# EAGLE board CSv2.1_exp_board (EAGLE 9.6.2)
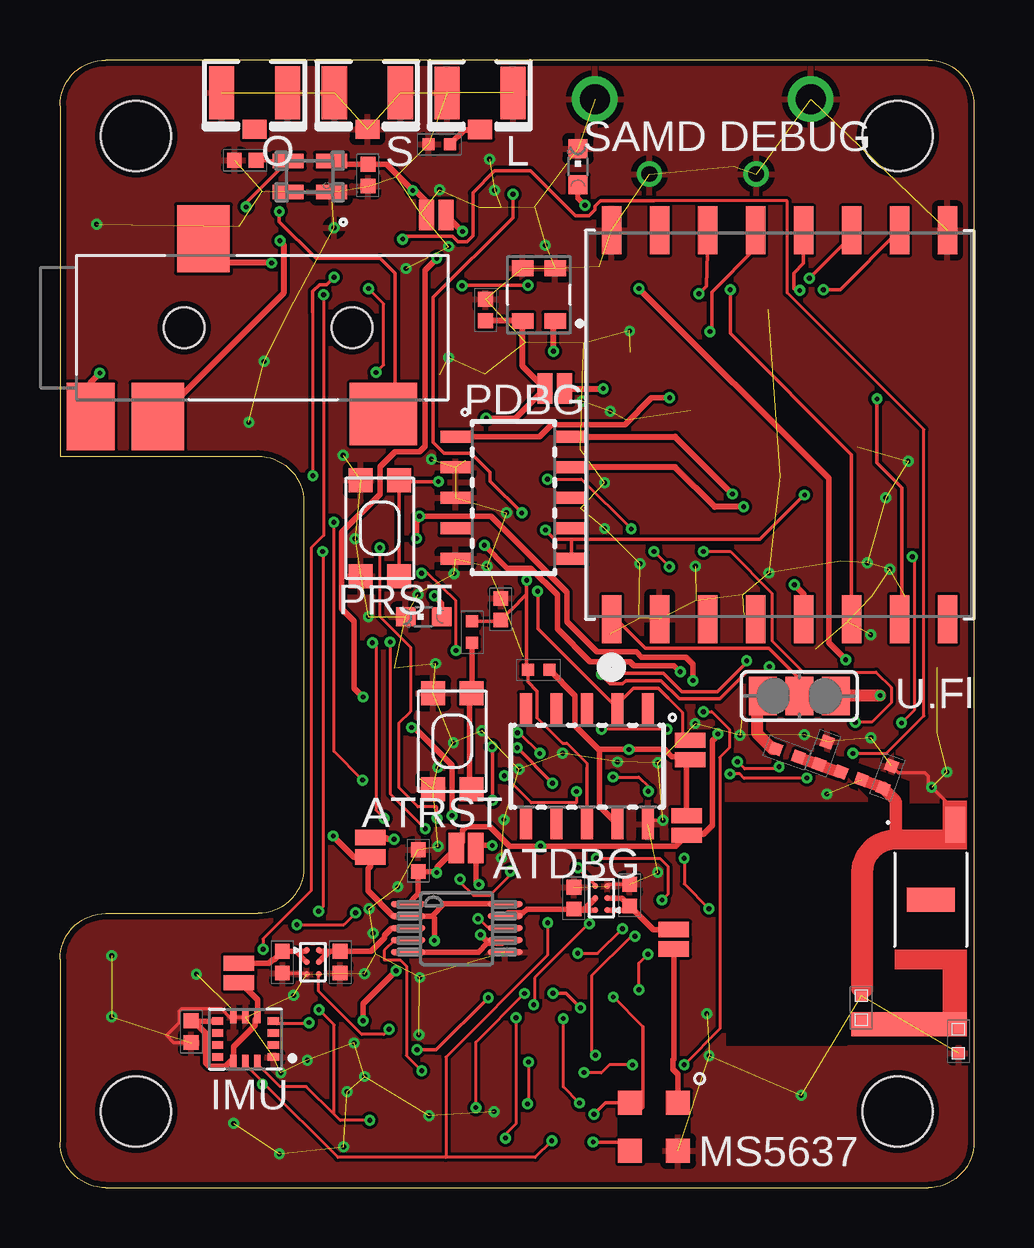
[diagram p4: board, top side]
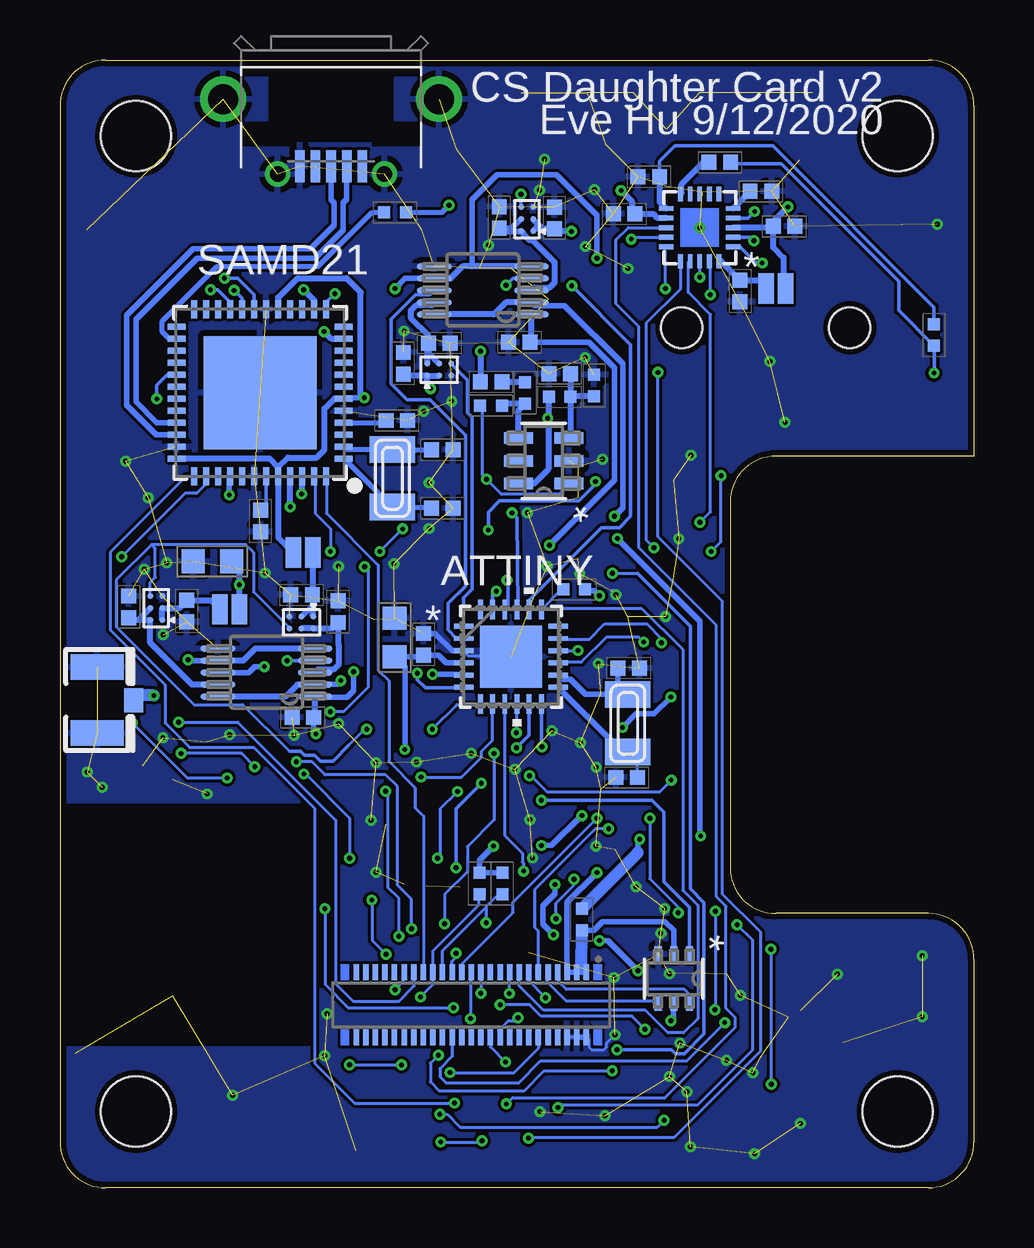
[diagram p5: board, bottom side, seen from below]

Size 38.1 x 46.99 mm. Coordinates in mm from the lower left corner, seen from the top.
Outline: 1.91,0 36.2,0 arc90 38.1,1.91 38.1,45.09 arc90 36.2,46.99 1.91,46.99 arc90 0,45.09 0,30.48 8.26,30.48 arc-90 10.16,28.57 10.16,13.34 arc-90 8.26,11.43 1.91,11.43 arc90 0,9.53 0,1.91 arc90 1.91,0
Copper layers (1*16): Top 0.034796875mm / dielectric 0.231140625mm / Bottom 0.034796875mm
Design rules "CSv2_bittele_4-layer *": minimum track width 5mil, minimum drill 0.2mm, track to track 5mil, track to pad 5mil, pad to pad 5mil, via to via 5mil, smd to smd 5mil, copper to edge 10mil, drill to drill 5mil, minimum pad ring 5mil, minimum via ring 5mil, stop-mask expansion 4mil, vias tented up to drill 0mil, thermal gap 10mil
Net classes: 0 default: width 0.127 mm, drill 0.152 mm, clearance 0.127 mm; 1 power: width 0.229 mm, drill 0.178 mm, clearance 0.127 mm; 2 diff_pair: width 0.229 mm; 3 12mil: width 0.305 mm, drill 0.33 mm; 8 GND: width 0.127 mm
Holes 2.92 mm at 3.17,43.81 34.92,43.81 3.17,3.17 34.92,3.17

## Footprints (pad centres in the part's own frame; a part is rotated, then mirrored left to right if it is on the bottom)
ILA_09_CHIP_ANTENNA = smd 1.5 x 0.8: G1 -3.11,1.02 | smd 1 x 4.8: G2 5.2,-0.9 | smd 1 x 2: NC 0,0
C0402 = smd 0.62 x 0.62: 1 -0.45,0; 2 0.45,0
C0402-S = smd 0.5 x 0.5: 1 -0.5,0; 2 0.5,0
C0603 = smd 0.95 x 1: 1 -0.8,0; 2 0.8,0
CHIPLED_0603 = smd 0.8 x 0.8: A 0,-0.75; C 0,0.75
HRS_DF40C-50DP-0.4V(51) = smd 0.23 x 0.66: 1 -4.8,1.355; 2 -4.8,-1.355; 3 -4.4,1.355; 4 -4.4,-1.355; 5 -4,1.355; 6 -4,-1.355; 7 -3.6,1.355; 8 -3.6,-1.355; 9 -3.2,1.355; 10 -3.2,-1.355; 11 -2.8,1.355; 12 -2.8,-1.355; 13 -2.4,1.355; 14 -2.4,-1.355; 15 -2,1.355; 16 -2,-1.355; 17 -1.6,1.355; 18 -1.6,-1.355; 19 -1.2,1.355; 20 -1.2,-1.355; 21 -0.8,1.355; 22 -0.8,-1.355; 23 -0.4,1.355; 24 -0.4,-1.355; 25 0,1.355; 26 0,-1.355; 27 0.4,1.355; 28 0.4,-1.355; 29 0.8,1.355; 30 0.8,-1.355; 31 1.2,1.355; 32 1.2,-1.355; 33 1.6,1.355; 34 1.6,-1.355; 35 2,1.355; 36 2,-1.355; 37 2.4,1.355; 38 2.4,-1.355; 39 2.8,1.355; 40 2.8,-1.355; 41 3.2,1.355; 42 3.2,-1.355; 43 3.6,1.355; 44 3.6,-1.355; 45 4,1.355; 46 4,-1.355; 47 4.4,1.355; 48 4.4,-1.355; 49 4.8,1.355; 50 4.8,-1.355
SAMTECH_FTSH-105-01 = smd 0.508 x 1.27: 1 -2.54,-2.413; 2 -2.54,2.413; 3 -1.27,-2.413; 4 -1.27,2.413; 5 0,-2.413; 6 0,2.413; 7 1.27,-2.413; 8 1.27,2.413; 9 2.54,-2.413; 10 2.54,2.413
CUI_SJ-43514-SMT-TEMP = smd 2 x 2.8: 1 -7.15,-3.7 | smd 2.8 x 2.6: 2 5.05,-3.6 | smd 2.2 x 2.8: 3 -2.45,3.7; 4 -4.35,-3.7 | hole 1.7: -3.25,0; 3.75,0
USB-THRU-ZX62D-AB-5P8 = smd 1.35 x 0.4: D+ 2.8,0; D- 2.8,0.65; GND 2.8,-1.3; USBID 2.8,-0.65; VBUS 2.8,1.3 | drill 1.25 pad 1.9: S1 0,-4.5; S2 0,4.5 | drill 0.65 pad 1.05: S3 3.125,2.225; S4 3.125,-2.225
SMT-JUMPER_2_NC_PASTE_NO-SILK = smd 0.635 x 1.27: 1 -0.406,0; 2 0.406,0
SMT-JUMPER_2_NO_PASTEFREE_NO-SILK = smd 0.635 x 1.27: 1 -0.406,0; 2 0.406,0
MIC_SPW2430HR5H-B = smd 0.9 x 0.66: 1 -0.675,1.095; 2 -0.675,-1.095; 3 0.675,-1.095; 4 0.675,1.095
R0402 = smd 0.5 x 0.5: 1 -0.45,0; 2 0.45,0
L0402 = smd 0.5 x 0.5: 1 -0.45,0; 2 0.45,0
JUMPER_SJ_2 = smd 1.168 x 1.6: 1 -1.524,0; 2 0,0; 3 1.524,0
KMR2 = smd 1 x 1: 1 2,0.8; 2 2,-0.8; 3 -2,0.8; 4 -2,-0.8
WLCSP6_2X3 = smd 0.254 x 0.254: A1 -0.25,0.5; A2 0.25,0.5; B1 -0.25,0; B2 0.25,0; C1 -0.25,-0.5; C2 0.25,-0.5
RJ_6-L = smd 1.206 x 0.48: 1 -1.049,0.95; 2 -1.049,0; 3 -1.049,-0.95; 4 1.049,-0.95; 5 1.049,0; 6 1.049,0.95
DGS0010A_L = smd 1.45 x 0.25: 1 -2.025,1; 2 -2.025,0.5; 3 -2.025,0; 4 -2.025,-0.5; 5 -2.025,-1; 6 2.025,-1; 7 2.025,-0.5; 8 2.025,0; 9 2.025,0.5; 10 2.025,1
RFM-MOD = smd 2 x 0.8: 1P 8.1,-7; 2P 8.1,-5; 3P 8.1,-3; 4P 8.1,-1; 5P 8.1,1; 6P 8.1,3; 7P 8.1,5; 8P 8.1,7; 9P -8.1,7; 10P -8.1,5; 11P -8.1,3; 12P -8.1,1; 13P -8.1,-1; 14P -8.1,-3; 15P -8.1,-5; 16P -8.1,-7
PQFN50P300X250X88-14N = smd 0.5 x 0.3: 1 -1.165,0.75; 2 -1.165,0.25; 3 -1.165,-0.25; 4 -1.165,-0.75; 8 1.165,-0.75; 9 1.165,-0.25; 10 1.165,0.25; 11 1.165,0.75 | smd 0.3 x 0.5: 5 -0.5,-0.915; 6 0,-0.915; 7 0.5,-0.915; 12 0.5,0.915; 13 0,0.915; 14 -0.5,0.915
KS_6_ADI-L = smd 0.673 x 0.305: 1 -1.01,0.65; 2 -1.01,0; 3 -1.01,-0.65; 4 1.01,-0.65; 5 1.01,0; 6 1.01,0.65
SC-82AB_ONS-L = smd 0.61 x 1.295: 1 -0.65,-0.902; 2 0.65,-0.902; 3 0.65,0.902; 4 -0.65,0.902
ATTINY817-MFRQFN24_RX4MC-L_QFN24_4X4MC = smd 0.813 x 0.203: 1 -1.968,1.27; 2 -1.968,0.762; 3 -1.968,0.254; 4 -1.968,-0.254; 5 -1.968,-0.762; 6 -1.968,-1.27; 13 1.968,-1.27; 14 1.968,-0.762; 15 1.968,-0.254; 16 1.968,0.254; 17 1.968,0.762; 18 1.968,1.27 | smd 0.203 x 0.813: 7 -1.27,-1.968; 8 -0.762,-1.968; 9 -0.254,-1.968; 10 0.254,-1.968; 11 0.762,-1.968; 12 1.27,-1.968; 19 1.27,1.968; 20 0.762,1.968; 21 0.254,1.968; 22 -0.254,1.968; 23 -0.762,1.968; 24 -1.27,1.968 | smd 2.591 x 2.591: 25 0,0
MICROBUILDER_TQFN48_7MM = smd 0.25 x 0.75: 1 -2.75,-3.475; 2 -2.25,-3.475; 3 -1.75,-3.475; 4 -1.25,-3.475; 5 -0.75,-3.475; 6 -0.25,-3.475; 7 0.25,-3.475; 8 0.75,-3.475; 9 1.25,-3.475; 10 1.75,-3.475; 11 2.25,-3.475; 12 2.75,-3.475; 25 2.75,3.475; 26 2.25,3.475; 27 1.75,3.475; 28 1.25,3.475; 29 0.75,3.475; 30 0.25,3.475; 31 -0.25,3.475; 32 -0.75,3.475; 33 -1.25,3.475; 34 -1.75,3.475; 35 -2.25,3.475; 36 -2.75,3.475 | smd 0.75 x 0.25: 13 3.475,-2.75; 14 3.475,-2.25; 15 3.475,-1.75; 16 3.475,-1.25; 17 3.475,-0.75; 18 3.475,-0.25; 19 3.475,0.25; 20 3.475,0.75; 21 3.475,1.25; 22 3.475,1.75; 23 3.475,2.25; 24 3.475,2.75; 37 -3.475,2.75; 38 -3.475,2.25; 39 -3.475,1.75; 40 -3.475,1.25; 41 -3.475,0.75; 42 -3.475,0.25; 43 -3.475,-0.25; 44 -3.475,-0.75; 45 -3.475,-1.25; 46 -3.475,-1.75; 47 -3.475,-2.25; 48 -3.475,-2.75 | smd 4.7 x 4.7: THERMAL 0,0
MS5637 = smd 1 x 1: 1 -1,1; 2 -1,-1; 3 1,-1; 4 1,1
SGTL5000-QFN20 = smd 0.6 x 0.2: P$1 -1.4,0.8; P$2 -1.4,0.4; P$3 -1.4,0; P$4 -1.4,-0.4; P$5 -1.4,-0.8; P$11 1.4,-0.8; P$12 1.4,-0.4; P$13 1.4,0; P$14 1.4,0.4; P$15 1.4,0.8 | smd 0.2 x 0.6: P$6 -0.8,-1.4; P$7 -0.4,-1.4; P$8 0,-1.4; P$9 0.4,-1.4; P$10 0.8,-1.4; P$16 0.8,1.4; P$17 0.4,1.4; P$18 0,1.4; P$19 -0.4,1.4; P$20 -0.8,1.4 | drill 0.2: PAD 0,0
ADAFRUIT2_XTAL3215 = smd 1.1 x 1.9: P$1 1.2,0; P$2 -1.2,0
U.FL = smd 2.2 x 1.05: 1 0,1.375; 2 0,-1.375 | smd 0.8 x 1: 3 1.525,0

## Placement (x,y rotation side)
A1  ILA09_CHIP_ANTENNA  [ILA_09_CHIP_ANTENNA]  36.29,12.01 270 top
C1  1u  [C0402]  29.74,27.78 270 bottom
C2  5.5p  [C0402]  22.16,28.31 0 bottom
C3  3.9p  [C0402-S]  37.46,6.1 90 top
C4  5.5p  [C0402]  22.16,30.75 0 bottom
C5  2.2p  [C0402-S]  33.4,7.5 270 top
C6  0.68u  [C0402]  20.13,33.58 0 bottom
C7  0.1u  [C0402]  17.74,36.58 90 top
C8  1u  [C0402]  17.27,33.92 180 bottom
C9  10u  [C0603]  31.75,26.1 180 bottom
C10  1u  [C0402]  26.5,24 90 bottom
C11  0.1u  [C0402]  28.03,24.7 180 bottom
C12  4.7u  [C0603]  24.14,22.92 270 bottom
C13  0.1u  [C0402]  22.94,22.64 270 bottom
C14  1u  [C0402]  24.06,31.97 0 bottom
C15  13pF  [C0402]  14.48,17.09 0 bottom
C16  13pF  [C0402]  14.39,21.65 180 bottom
C17  1u  [C0402]  35.23,24.21 90 bottom
C18  0.1u  [C0402]  32.82,24.03 270 bottom
C19  1u  [C0402]  21.42,12.06 90 top
C20  0.1u  [C0402]  23.75,12.19 90 top
C21  1u  [C0402]  11.68,9.4 270 top
C22  0.1u  [C0402]  9.27,9.4 270 top
C23  1u  [C0402]  22.29,35.19 0 bottom
C24  0.1u  [C0402]  23.79,34.35 90 bottom
C25  0.1u  [C0402]  5.47,6.5 270 top
C26  22p  [C0402-S]  30.31,18.12 340 top
C27  0.1u  [C0402]  7.91,40.06 0 bottom
C28  0.1u  [C0402]  8.88,41.52 0 bottom
C29  1u  [C0402]  19.79,40.42 90 bottom
C30  0.1u  [C0402]  17.49,40.41 90 bottom
C31  0.1u  [C0402]  10.59,42.72 180 bottom
C32  1u  [C0402]  13.55,42.13 0 bottom
C33  0.1u  [C0402]  7.72,42.81 180 top
C35  0.1u  [C0402]  14.58,40.58 180 bottom
C36  0.1u  [C0402]  9.75,37.36 270 bottom
C42  1u  [C0402]  12.84,42.19 270 top
C43  0.1u  [C0402]  18.95,35.23 180 bottom
C44  0.1u  [C0402]  14.94,13.63 90 top
C45  0.1u  [C0402]  27.98,19.6 180 bottom
C46  4.7n  [C0402]  18.38,24.1 270 top
GREEN_LED  [CHIPLED_0603]  15.16,23.79 90 top
J1  HIROSE-DF40_50-PIN_CONNECTORS-HEADER  [HRS_DF40C-50DP-0.4V(51)]  20.95,7.62 180 bottom
J3  CORTEX_DEBUG_SMD  [SAMTECH_FTSH-105-01]  18.91,28.75 270 top
J4  SJ-43514-SMTC  [CUI_SJ-43514-SMT-TEMP]  8.43,35.84 0 top
J6  ATTINY_AVR_DEBUG  [SAMTECH_FTSH-105-01]  21.97,17.56 180 top
J7  J-USB-HIROSE-MICRO-USB  [USB-THRU-ZX62D-AB-5P8]  26.8,45.36 270 bottom
JP1  JUMPER-SMT_2_NC_PASTELG_NO-SILK  [SMT-JUMPER_2_NC_PASTE_NO-SILK]  31.03,24.1 0 bottom
JP2  JUMPER-SMT_2_NC_PASTELG_NO-SILK  [SMT-JUMPER_2_NC_PASTE_NO-SILK]  27.97,26.47 180 bottom
JP3  JUMPER-SMT_2_NC_PASTELG_NO-SILK  [SMT-JUMPER_2_NC_PASTE_NO-SILK]  25.59,10.35 270 top
JP4  JUMPER-SMT_2_NC_PASTELG_NO-SILK  [SMT-JUMPER_2_NC_PASTE_NO-SILK]  26.12,15.09 90 top
JP5  JUMPER-SMT_2_NC_PASTELG_NO-SILK  [SMT-JUMPER_2_NC_PASTE_NO-SILK]  7.47,8.95 270 top
JP6  JUMPER-SMT_2_NC_PASTELG_NO-SILK  [SMT-JUMPER_2_NC_PASTE_NO-SILK]  20.62,33.3 180 top
JP12  JUMPER-SMT_2_NC_PASTELG_NO-SILK  [SMT-JUMPER_2_NC_PASTE_NO-SILK]  16.93,14.16 0 top
JP13  JUMPER-SMT_2_NC_PASTELG_NO-SILK  [SMT-JUMPER_2_NC_PASTE_NO-SILK]  12.94,14.19 270 top
JP14  JUMPER-SMT_2_NO_PASTEFREE  [SMT-JUMPER_2_NO_PASTEFREE_NO-SILK]  26.28,18.24 90 top
JP15  JUMPER-SMT_2_NC_PASTELG_NO-SILK  [SMT-JUMPER_2_NC_PASTE_NO-SILK]  15.68,40.53 180 top
JP16  JUMPER-SMT_2_NO_PASTEFREE  [SMT-JUMPER_2_NO_PASTEFREE_NO-SILK]  8.26,37.47 0 bottom
MK1  SPW2430HR5H-B  [MIC_SPW2430HR5H-B]  19.96,37.21 180 top
R1  4.99k  [R0402]  18.71,33.12 90 bottom
R2  100k  [R0402]  20.13,32.59 0 bottom
R3  100k  [R0402]  15.84,33.43 90 bottom
R4  100k  [R0402]  17.27,32.96 0 bottom
R5  4.7k  [R0402]  20.61,12.67 270 bottom
R6  4.7k  [R0402]  19.66,12.67 270 bottom
R7  50R  [R0402]  15.81,43.47 180 top
R8  0R  [R0402]  1.66,35.53 270 bottom
R9  39R  [R0402]  17.18,23.15 90 top
R10  100k  [R0402]  19.95,21.58 0 top
R11  1k  [R0402]  24.13,40.64 180 bottom
R12  1k  [R0402]  16.66,24.93 0 bottom
R27  0R  [C0402-S]  31.81,18.1 70 top
R28  0R  [C0402-S]  34.49,17.11 70 top
R30  0R  [L0402]  32.98,17.16 340 top
R_SENSE  1.33R  [R0402]  16.34,11.18 90 bottom
RED_LED  [CHIPLED_0603]  21.59,42.55 0 top
SJ3  [JUMPER_SJ_2]  30.82,20.49 359.9 top
SW1  SPST_TACT-KMR2  [KMR2]  16.36,18.61 90 top
SW2  SPST_TACT-KMR2  [KMR2]  13.34,27.48 90 top
U1  LOADSWITCH-MIC94164  [WLCSP6_2X3]  28.03,23.56 270 bottom
U2  ADA4841-1YRJZ-R7RJ_6-L  [RJ_6-L]  17.93,30.29 180 bottom
U3  Value  [DGS0010A_L]  20.47,37.39 180 bottom
U4  RFM69HCW  [RFM-MOD]  30,31.79 270 top
U5  Value  [DGS0010A_L]  16.54,10.82 0 top
U6  Value  [DGS0010A_L]  29.49,21.46 180 bottom
U7  LOADSWITCH-MIC94164  [WLCSP6_2X3]  34.09,24.16 180 bottom
U8  LOADSWITCH-MIC94164  [WLCSP6_2X3]  22.57,12.06 180 top
U9  LOADSWITCH-MIC94164  [WLCSP6_2X3]  10.54,9.4 0 top
U10  LOADSWITCH-MIC94164  [WLCSP6_2X3]  22.29,34.09 90 bottom
U11  BMI160  [PQFN50P300X250X88-14N]  7.73,6.2 180 top
U13  ADG839YKSZ-500RL7KS_6_ADI-L  [KS_6_ADI-L]  12.51,8.71 270 bottom
U14  LOADSWITCH-MIC94164  [WLCSP6_2X3]  18.63,40.36 180 bottom
U16  NCP553SQ18T1GSC-82AB_ONS-L  [SC-82AB_ONS-L]  10.41,42.14 90 top
U17  ATTINY817-MFRQFN24_RX4MC-L_ATTINY817-MFR  [ATTINY817-MFRQFN24_RX4MC-L_QFN24_4X4MC]  19.3,22.12 0 bottom
U19  ATSAMD21G18_QFN  [MICROBUILDER_TQFN48_7MM]  29.75,33.13 90 bottom
U206  MS5637  [MS5637]  24.77,2.54 270 top
U$1  [SGTL5000-QFN20]  11.43,40.01 180 bottom
X1  32.768kHz  [ADAFRUIT2_XTAL3215]  14.43,19.35 90 bottom
X2  32.768kHz  [ADAFRUIT2_XTAL3215]  24.24,29.56 270 bottom
X3  uFL  [U.FL]  8.12,45.63 270 top
X4  uFL  [U.FL]  36.55,20.32 0 bottom
X5  uFL  [U.FL]  12.81,45.63 270 top
X6  uFL  [U.FL]  17.51,45.62 270 top

## Tracks (layer width: path | path; a pad name or v marks a point on that pad's centre or on a via)
+1V8_CODEC  (via drill 0.2)
  Top 0.152: v7.76,40.87 7.76,41.04 U16.3 8.2,42.79 C33.1
  Bottom 0.254: JP16.2 7.94,37.56 7.94,38.76 8.36,39.18 C27.1 | C27.1 8.41,40.01 U$1.P$3 | v7.76,40.87 8.36,40.27 C27.1
+3V3_ATT  (via drill 0.2)
  Top 0.229: JP4.2 26.12,17.64 26.33,17.84 26.33,17.88 | 26.33,17.88 26.33,17.96 25.51,17.96 25.21,18.26 v23.72,18.26 22.45,18.26 | JP14.1 26.33,17.88 | J6.4 22.49,15.9 22.49,18.23 22.45,18.26 | R10.2 21.48,20.5 21.48,19.24 22.45,18.26
  Bottom 0.229: U17.4 21.29,21.88 22,21.88 22.31,22.19 C13.2 23.01,22.12 C12.2 23.72,21.7 v23.72,18.26
+3V3_BARO
  Top 0.229: U206.1 25.77,4.73 25.55,4.94 25.55,5.33 25.59,5.36 JP3.2
+3V3_BARO_IN
  Top 0.229: U8.A2 21.48,11.56 C19.1 | C19.1 21.87,11.62 U8.B2 | U5.9 18.69,11.45 19.31,11.45 19.47,11.62 C19.1
+3V3_BARO_OUT
  Top 0.229: JP3.1 24.73,10.76 C20.1 | C20.1 23.43,12.06 U8.B1 | U8.A1 23.57,11.56 C20.1
+3V3_CODEC  (via drill 0.2)
  Top 0.229: U16.2 11.46,42.64 C42.1 13.62,42.64 v14.71,41.55
  Top 0.254: v14.71,41.55 14.81,41.55 15.28,41.08 JP15.2
  Bottom 0.254: U$1.P$12 12.85,40.42 13.21,40.42 13.36,40.58 C35.1 14.29,40.58 14.26,40.54 14.26,41.11 v14.71,41.55
+3V3_CODEC_IN
  Bottom 0.254: U14.B2 19.27,39.97 C29.1 19.67,39.86 U14.A2 18.76,39.74 18.76,39.7 18.54,39.48 18.4,39.48 17.47,38.55 17.47,37.73 17.69,37.51 18.33,37.51 U3.3
+3V3_CODEC_OUT  (via drill 0.2)
  Top 0.254: v16.78,39.85 v16.77,39.85 JP15.1
  Bottom 0.254: C30.1 18.28,39.96 U14.A1 | U14.B1 17.98,39.96 C30.1 | C30.1 17.3,39.96 17.18,39.85 v16.78,39.85
+3V3_DTR  (via drill 0.2)
  Top 0.229: U5.1 14.94,12.24 C44.1 14.96,13.16 15.7,13.16 15.71,13.14 v15.71,13.13 15.71,13.35 JP12.1 16.78,14.41 16.78,14.89 16.92,15.04 17.93,15.04 18.73,14.24 v20.03,14.24 25.67,14.24 JP4.1 26.16,14.72 26.82,14.72 27.19,15.1 27.19,18.62 27.43,18.86 v27.43,18.91 | v17.69,26.77 18.64,25.82 19.62,25.82 20.73,24.71 20.73,23.29 22.1,21.92 23.76,21.92 23.93,21.75 25.6,21.75 v25.86,21.5
  Bottom 0.229: J1.6 J1.4 | J1.6 J1.2 16.35,9.17 | R_SENSE.1 15.84,10.73 15.48,11.09 12.87,11.09 12.51,10.72 U13.2 | v15.71,13.13 16.95,11.89 J1.6 | v20.03,14.24 20.61,13.65 R5.1 R6.1 | C45.1 27.53,19.01 v27.43,18.91 | U6.1 27.45,20.45 26.12,20.45 25.86,20.71 v25.86,21.5 | C43.1 16.06,35.23 14.99,34.16 14.99,29.47 v17.69,26.77
  Bottom 0.254: C43.1 18.45,35.28 U3.1 | C45.1 27.46,19.66 U6.1
  Bottom 0.508: 16.35,9.17 R_SENSE.1
+3V3_IMU
  Top 0.229: JP5.2 7.53,8.55 8.23,7.84 U11.5 8.13,7 8.13,6.77 7.23,5.88 U11.12 7.14,5.28 6.91,5.06 6.23,5.06 6.08,5.21 6.08,6.44 5.71,6.8 5.71,6.95 | U11.8 5.71,6.95 | 5.71,6.95 C25.1
+3V3_IMU_IN
  Top 0.229: U9.B2 11.24,9.85 C21.1 | C21.1 10.84,9.85 U9.A2 | U5.3 13.83,10.82 13.52,10.51 13.52,10.41 12.96,9.85 C21.1
+3V3_IMU_OUT
  Top 0.229: U9.A1 10.24,9.85 C22.1 | C22.1 9.84,9.85 U9.B1 | C22.1 8.92,9.5 8.86,9.5 8.72,9.36 JP5.1
+3V3_MEAS  (via drill 0.2)
  Top 0.229: 15.51,11.32 U5.2 13.89,11.32 12.84,12.37 12.84,13.3 12.94,13.4 JP13.2 12.27,13.78 v11.39,14.66 | 15.51,11.32 16.02,11.82 U5.10 | v26.39,21.13 26.39,21.82 26.1,22.11 24.24,22.11 24.03,22.33 22.39,22.33 21.14,23.58 21.14,24.81 17.97,27.98 v14.99,27.98 14.99,27.88 14.86,27.75 v14.86,27.05 | v12.64,6.96 12.64,7.67 v14.01,9.04 | v15.61,10.3 15.61,11.22 15.51,11.32
  Bottom 0.229: U3.2 18.32,36.76 17.06,36.76 14.63,34.33 14.63,28.33 v14.99,27.98 | U6.2 27.45,20.98 26.54,20.98 v26.39,21.13 | U13.5 12.54,7.68 12.54,7.06 v12.64,6.96 | v14.01,9.04 15.27,10.3 v15.61,10.3 | v11.39,14.66 11.42,14.68 11.42,23.61 v14.86,27.05
  Bottom 0.254: U3.2 19.51,36.89 20.01,36.39 U3.10 | U6.2 28.2,20.96 28.7,20.46 U6.10
+3V3_MIC  (via drill 0.2)
  Top 0.254: C7.1 MK1.4 19.29,34.23 JP6.2 18.99,32.07 v17.77,32.07
  Bottom 0.229: v17.77,32.07 17.74,32.07
  Bottom 0.254: R4.1 17.74,32.94 17.74,32.07 17.74,29.95 18.35,29.34 U2.6
+3V3_MIC_IN
  Bottom 0.254: U3.9 22.62,36.77 23.25,36.77 23.48,36.55 23.48,36.23 22.74,35.49 C23.1 | C23.1 22.79,35.14 U10.A2 | C23.1 22.74,34.79 U10.B2
+3V3_MIC_OUT  (via drill 0.2)
  Top 0.254: JP6.1 v22.64,33.3
  Bottom 0.254: U10.A1 23.72,33.84 C24.1 | U10.A1 U10.B1 | v22.64,33.3 22.79,33.44 U10.A1
+3V3_NMEAS  (via drill 0.2)
  Top 0.229: U5.7 18.43,10.19 17.81,10.19 | U5.5 17.44,9.82 17.81,10.19 | v24.13,37.47 32.04,29.55 32.04,22.71 v32.75,22 | v17.46,12.64 17.34,12.76 JP12.2 17.44,14.26 v18.02,14.26 | v17.53,10.54 17.78,10.29 17.81,10.19 | v16.34,15.51 16.34,17.61 14.78,19.18 v14.66,19.18 | v12.64,20.45 12.27,20.82 12.27,23.6 11.75,24.12 11.75,27.3 13.34,28.89 13.34,30.04 13.97,30.67 14.99,30.67 15.21,30.9 15.21,38.24 v15.71,38.73
  Bottom 0.229: U3.7 23.71,37.89 v24.13,37.47 | v32.75,22 32.72,21.96 U6.7 | v17.46,12.64 17.46,12.26 17.97,11.75 17.97,10.99 v17.53,10.54 | v18.02,14.26 17.61,14.26 16.37,15.51 v16.34,15.51 | v14.66,19.18 14.08,19.75 13.34,19.75 v12.64,20.45 | v15.71,38.73 15.71,40.53 17.4,42.22 19.89,42.22 20.93,41.17 20.93,38.39
  Bottom 0.254: U3.5 20.93,38.39 21.31,38.39 21.81,37.89 U3.7 | U6.5 29.96,22.46 30.45,21.98 31.5,21.98 U6.7
+3V3_RFM  (via drill 0.2)
  Top 0.254: v30.62,25.12 31,24.74 U4.5P
  Bottom 0.254: C9.1 30.62,25.77 JP1.2 v30.62,25.12
+3V3_RFM_IN
  Bottom 0.254: U6.9 32.6,20.96 34.34,22.7 U7.A2 34.84,23.66 | C17.1 35.13,23.66 34.84,23.66 | U7.B2 34.84,23.66
+3V3_RFM_OUT
  Bottom 0.254: U7.A1 U7.B1 33.14,24.16 C18.1 31.81,24.48 JP1.1
+3V3_SAMD  (via drill 0.2)
  Top 0.229: v25.41,32.92 24.66,32.92 23.55,31.8 20.5,31.8 19.99,31.29 J3.1
  Bottom 0.229: U19.6 26.24,32.92 v25.41,32.92 25.57,33.07
  Bottom 0.254: U19.44 29,29.66 | 29,29.66 29,30.01 29.37,30.38 U19.36 | U19.44 29,29.66 | 29,29.66 29,30.02 28.59,30.42 27.4,30.42 27.08,30.75 27.08,32.46 26.66,32.88 U19.6 | U19.17 29.01,37.09 28.19,37.9 26.16,37.9 25.57,37.31 25.57,33.07 | U19.44 29,27.1 JP2.2
+3V3_SAMD_IN
  Bottom 0.254: U1.B2 U1.A2 26.75,23.31 C10.1 26.5,22.64 26.48,22.62 26.48,21.79 26.7,21.58 27.34,21.58 U6.3
+3V3_SAMD_OUT
  Bottom 0.254: JP2.1 27.58,26.45 C11.1 | U1.A1 27.58,23.86 C11.1 | C11.1 27.58,24.26 U1.B1
AREF
  Bottom 0.203: C14.1 24.6,31.88 U19.4
AT_RESET  (via drill 0.2)
  Top 0.127: 19.89,19.59 20.95,18.53 21.13,18.53 21.97,17.68 21.97,17.5
  Top 0.152: 21.97,17.5 J6.6 | R9.2 18.32,23.6 C46.2 18.76,24.04 18.77,24.04 19.46,24.73 v19.46,25.31 19.46,21.62 R10.1 19.5,21.08 19.89,20.7 19.89,19.59
  Bottom 0.152: v19.46,25.31 19.42,25.27 19.42,24.23 U17.22
AT_UPDI  (via drill 0.2)
  Top 0.127: 25.34,20.41 25.95,19.81 25.95,18.71 26.01,18.64 JP14.2
  Top 0.152: v19.91,24.85 v19.92,24.85 19.92,23.29 22.28,20.93 22.29,20.93 23.15,20.07 | 23.15,20.07 J6.3 | 25.34,20.41 24.94,20.82 23.9,20.82 23.15,20.07
  Bottom 0.152: U17.23 20.07,24.7 v19.91,24.85
CODEC_VDDD
  Bottom 0.254: U$1.P$20 10.54,38.6 C36.1 8.78,37.81 8.68,37.72 8.68,37.48 JP16.1
D_N
  Bottom 0.229: U19.33 34.06,31.88 34.92,32.74 34.92,36.2 32.38,38.73 27.47,38.73 26.3,39.9 26.3,41.03 26.15,41.19 J7.D-
D_P
  Bottom 0.229: U19.34 34.1,31.38 35.32,32.6 35.32,36.36 32.55,39.13 27.65,39.13 26.67,40.11 26.67,41.04 26.8,41.16 J7.D+
DTR_BUS0_GPIO0/I2S_SCK  (via drill 0.2)
  Top 0.127: v12.86,37.47 13.49,36.83 13.49,34.29 v13.18,33.97 | v18.57,2.07 18.57,2.22 19.01,2.66 v19.01,7.09
  Bottom 0.127: v12.86,37.47 12.86,39.21 U$1.P$15 | v13.18,33.97 13.18,27.13 10.48,24.43 10.48,12.22 8.89,10.64 8.89,5.7 12.48,2.11 18.53,2.11 v18.57,2.07 | v19.01,7.09 19.13,6.96 19.39,6.96 19.68,6.67 19.68,6.35 J1.19
DTR_BUS0_GPIO1/I2S_MCK  (via drill 0.2)
  Top 0.127: v19.49,3.49 19.53,3.52 v19.53,5.24
  Bottom 0.127: U$1.P$13 14.41,40.01 14.92,39.49 14.92,36.83 13.97,35.88 13.97,26.67 10.74,23.44 10.74,12.13 10.34,11.72 10.34,7.48 9.95,7.09 9.95,6.69 12.88,3.76 19.23,3.76 v19.49,3.49 | v19.53,5.24 20.16,5.87 20.16,6.19 J1.21
DTR_BUS0_P1/I2S_SDI  (via drill 0.2)
  Top 0.127: v11.42,27.72 11.42,18.19 v12.62,16.99 | v18.52,17.16 19.65,16.03 21.53,16.03 v21.53,16.51 | v24.5,9.73 24.13,9.36 v24.13,8.26 | v22.36,13.73 25.01,13.73 25.34,13.4 25.34,12.22 v25.1,11.99
  Bottom 0.127: v11.42,27.72 10.98,28.16 10.98,36.38 11.91,37.31 11.91,38.58 U$1.P$17 | v12.62,16.99 13.09,16.51 17.8,16.51 18.46,17.16 v18.52,17.16 | v21.53,16.51 22.25,15.79 22.25,13.84 v22.36,13.73 | v24.13,8.26 23.81,8.57 23.81,8.89 J1.40 | v25.1,11.99 25.08,11.97 25.08,10.31 v24.5,9.73
DTR_BUS0_P2/I2S_FS0  (via drill 0.2)
  Top 0.127: 24.77,41.12 30.32,41.12 30.32,37.29 36.01,31.6 36.01,19.66 34.45,18.1 v33.05,18.1 | v29.98,17.54 30.01,17.51 30.01,17.45 28.55,17.45 v28.25,17.75 | v23.44,10.79 22.42,9.77 v21.58,9.77
  Top 0.152: 24.77,41.12 22.54,41.12 22.31,40.89 22.31,40.75 22.06,40.5 21.49,40.5 19.62,42.37 18.12,42.37 17.21,41.46 17.21,39.67 16.96,39.42 16.6,39.42 16.37,39.65 14.41,39.65 v14.29,39.53
  Bottom 0.127: v14.29,39.53 14.21,39.6 U$1.P$14 | U$1.P$14 | v33.05,18.1 30.54,18.1 v29.98,17.54 | v23.44,10.79 23.44,12.01 24.04,12.61 24.04,16.72 24.52,17.21 27.05,17.21 27.6,17.76 v28.24,17.76 v28.25,17.75 | J1.30 21.75,9.43 21.58,9.6 v21.58,9.77
DTR_BUS0_P3/I2S_SDO  (via drill 0.2)
  Top 0.127: v13.34,26.67 13.34,23.79 14.61,22.52 14.61,19.84 14.13,19.37 14.13,16.67 14.92,15.88 15.72,15.88 v15.72,15.4
  Bottom 0.127: v13.34,26.67 13.65,26.99 13.65,36.04 12.22,37.47 12.22,38.58 U$1.P$16 | v15.72,15.4 19.21,11.91 19.21,11.46 21.32,9.35 21.32,9 J1.28
DTR_BUS1_GPIO2/AIN0  (via drill 0.2)
  Top 0.127: v21.84,4.8 21.85,4.79 22.57,4.79 22.9,5.12 v23.86,5.12 | v26.02,5.13 27.51,6.62 27.51,17.93 27.9,18.33 27.9,19.11 27.17,19.84 v26.83,19.84 | v24.77,26.51 v25.4,25.88 | v23.81,27.45 21.74,29.53 v20.32,29.53
  Bottom 0.127: R2.1 20.48,32.54 20.48,29.69 v20.32,29.53 19.68,28.89 17.3,28.89 16.99,29.21 U2.1 | v21.84,4.8 19.17,4.8 18.14,5.84 18.14,6.24 J1.11 | v26.02,5.13 v23.85,5.13 v23.86,5.12 | v26.83,19.84 26.28,19.84 25.27,20.85 25.27,25.74 v25.4,25.88 | v23.81,27.45 24.75,26.51 v24.77,26.51
DTR_BUS1_P0  (via drill 0.2)
  Top 0.127: v33.15,19.4 33.85,19.4 34.65,20.21 34.65,20.85 34.02,21.49 30.98,21.49 29.69,22.78 29.69,24.77 27.94,26.51 v26.83,26.51
  Bottom 0.127: v33.15,19.4 30.69,19.4 26.61,15.32 26.61,8.51 25.88,7.78 23.97,7.78 23.34,8.41 23.34,8.89 J1.38 | v26.83,26.51 26.83,27.46 27.46,28.1 27.46,29.53 U19.47
DTR_BUS1_P1
  Bottom 0.127: J1.36 22.94,8.99 22.94,15.48 23.3,15.84 23.3,16.68 24.38,17.76 24.38,21.12 24.83,21.57 24.83,25.94 26.99,28.1 26.99,29.53 U19.48
DTR_BUS1_P2  (via drill 0.2)
  Top 0.127: v20.98,7.05 20.98,4.2 v21.65,3.53
  Bottom 0.127: v20.98,7.05 20.98,8.97 J1.26 | v21.65,3.53 25.82,3.53 27.48,5.19 27.48,15.81 30.02,18.35 32.7,18.35 33.72,19.37 33.72,20.95 36.01,23.24 36.01,26.48 32.84,29.64 U19.37
DTR_BUS1_P3  (via drill 0.2)
  Top 0.127: v27.06,11.63 26.02,12.66 v26.02,13.73 | v27.93,17.24 28.34,17.24 28.52,17.06 31.13,17.06 v31.13,17.07 | v35.08,19.37 35.6,19.89 35.6,26.22 v35.53,26.3
  Top 0.152: v21.7,7.51 21.1,8.1 v20.55,8.1
  Bottom 0.127: J1.24 | J1.24 v20.55,8.1 | v21.7,7.51 26.08,7.51 27.06,8.48 v27.06,11.63 | v26.02,13.73 26.02,15.39 27.87,17.24 v27.93,17.24 | v31.13,17.07 32.79,17.07 v35.08,19.37 | v35.53,26.3 32.89,28.94 32.4,28.94 32.07,29.27 32.07,29.53 U19.38
DTR_BUS2_GPIO0
  Bottom 0.127: 21.41,6.22 J1.27
DTR_BUS2_GPIO1  (via drill 0.2)
  Top 0.127: v10.39,6.88 10.39,6.83 9.05,6.83 U11.4
  Bottom 0.127: v10.39,6.88 v10.39,6.87 11.97,5.29 18.07,5.29 18.97,4.38 22.01,4.38 22.26,4.64 22.26,4.97 21.75,5.47 J1.29 | J1.29
DTR_BUS2_P0/I2C_SDA  (via drill 0.2)
  Top 0.127: U11.14 8.23,5.16 9.17,4.22 10.27,4.22 11.43,3.05 | 10.54,36.47 v10.54,29.66 | v10.95,26.51 10.97,26.49 10.97,11.72 v10.78,11.53 | v10.79,7.42 11.43,6.79 11.43,3.05 | 24.3,6.71 v23.06,7.95 | 11.43,3.05 11.68,2.81 v12.92,2.81
  Top 0.152: v11.43,37.94 11.12,37.63 10.81,37.63 10.54,37.36 10.54,36.47 | 24.3,6.71 24.3,3.35 24.13,3.17 U206.2 22.74,3.54 v22.26,3.06
  Bottom 0.127: R5.2 20.64,12.22 20.64,11.79 22.54,9.88 22.54,9.05 J1.34 22.54,8.89 22.54,8.47 v23.06,7.95 | v12.92,2.81 13.2,2.53 21.42,2.53 21.95,3.06 v22.26,3.06 | v11.43,37.94 U$1.P$18 | v10.54,29.66 10.54,26.92 v10.95,26.51 | v10.78,11.53 10.78,7.44 v10.79,7.42
DTR_BUS2_P1/I2C_SCL  (via drill 0.2)
  Top 0.127: 16.09,1.26 11.59,1.26 8.53,4.31 v8.44,4.31 8.44,4.42 7.73,5.12 U11.13 | 16.09,1.26 16.09,5.45 20.33,9.7 v20.33,11.04 | v10.99,37.2 10.99,27.18 10.48,26.67 10.48,12.38 8.46,10.37 v8.46,9.94 | v20.5,1.96 19.81,1.26 16.09,1.26
  Top 0.152: v22.23,1.91 23.4,1.91 U206.3
  Bottom 0.127: 20.33,11.69 20.33,11.72 19.83,12.22 R6.2 | 20.33,11.69 v20.33,11.04 | v10.99,37.2 10.99,38.59 U$1.P$19 | J1.32 22.17,8.99 22.17,9.86 20.33,11.69 | v20.5,1.96 20.56,1.91 v22.23,1.91 | v8.46,9.94 8.46,4.34 v8.44,4.31
DTR_DETECT
  Bottom 0.127: J1.16 18.95,8.42 17.94,7.4 13.7,7.4 12.75,6.46 12.1,6.46 11.51,7.05 11.51,11.77 12.14,12.39 12.14,22.43 13.84,24.13 18,24.13 U17.19 17.2,24.93 | J1.16
  Bottom 0.229: 17.2,24.93 R12.1
DTR_DETECT_LED  (via drill 0.2)
  Top 0.229: v15.61,24.66 15.91,24.36 GREEN_LED.A
  Bottom 0.229: R12.2 16.15,24.87 15.81,24.87 v15.61,24.66
DTR_IRQ  (via drill 0.2)
  Top 0.127: v19.37,8.1 17.34,6.06 v17.34,3.34 | v12.32,11.46 12.32,11.44 11.84,10.96 v9.87,10.96 | v13.51,15.4 13.17,15.73 13.17,22.57 v13.02,22.71
  Bottom 0.127: v19.37,8.1 19.37,8.89 J1.18 | v17.34,3.34 17.21,3.47 11.5,3.47 9.25,5.72 9.25,10.33 v9.87,10.96 | v12.32,11.46 12.32,11.68 13.51,12.87 v13.51,15.4 | v13.02,22.71 13.02,22.89 13.63,23.5 15.4,23.5 16.03,22.86 17.3,22.86 U17.17
DTR_V_SENSE0
  Bottom 0.127: J1.8 17.3,8.89 17.3,8.57 16.99,8.26 12.07,8.26 11.86,8.05 11.86,8.06 U13.6
DTR_V_SENSE1
  Bottom 0.127: J1.10 17.78,8.89 17.78,8.57 16.99,7.78 13.16,7.78 U13.4
EN_BARO  (via drill 0.2)
  Top 0.152: v20.54,16.85 19.06,18.33 v19.06,18.34 | v21.59,13.34 22.32,12.61 U8.C2
  Bottom 0.152: U17.11 18.54,18.86 v19.06,18.34 | v20.54,16.85 21.59,15.8 v21.59,13.34
EN_CODEC  (via drill 0.2)
  Top 0.152: v19.25,28.12 17.93,29.44 17.93,29.82 17.14,30.61 16.01,30.61 15.56,31.06 15.56,37.09 18.89,40.42 v18.89,41.4
  Bottom 0.152: U14.C2 v18.88,41.4 v18.89,41.4 | v19.25,28.12 19.05,27.92 19.01,24.13 U17.21
EN_IMU  (via drill 0.2)
  Top 0.127: v13.72,6.61 13.5,6.39 12.58,6.39 10.79,8.18 U9.C2 | v19.75,7.63 19.79,7.66 19.79,8.75 22.04,11.01 v22.07,11.01 | v20,18.1 19.14,18.95 v19.07,18.95
  Bottom 0.127: v22.07,11.01 22.07,12.22 21.11,13.18 21.11,14.22 20,15.33 v20,18.1 | U17.10 19.07,20.13 v19.07,18.95 | v13.72,6.61 14.26,7.15 18.04,7.15 18.52,7.63 v19.75,7.63
EN_MIC
  Bottom 0.152: U10.C2 21.11,33.65 21.11,32.3 20.91,32.1 20.91,24.93 21.27,24.57 U17.1
EN_RADIO  (via drill 0.2)
  Top 0.127: v25.31,19.1 v22.58,19.1
  Bottom 0.127: U1.C2 28.57,23.37 30.04,24.83 30.04,26.48 30.35,26.8 34.28,26.8 34.28,26.79 | v22.58,19.1 21.55,20.13 20.57,20.13 U17.7 | 26.06,18.44 25.4,19.1 v25.31,19.1 | 28.54,18.19 30.48,20.13 32.51,20.13 35.75,23.37 35.75,25.32 34.28,26.79 | U7.C2 34.34,25.22 34.12,25.43 34.12,26.63 34.28,26.79
  Bottom 0.152: 26.06,18.44 26.72,17.78 27.25,17.78 27.49,18.03 27.91,18.03 28.07,18.18 28.54,18.18 28.54,18.19
GND  (via drill 0.2)  (158 unrouted)
  Top 0.127: 34.13,16.74 34.18,16.88 R28.1
  Top 0.152: U11.6 U11.7 7.08,7.11 6.73,7.47 5.08,7.47 4.96,7.35 4.96,6.87 4.45,6.35 4.74,6.05 C25.2 | U8.C1 22.89,12.64 C20.2 | C22.2 10.24,8.95 U9.C1 | R30.2 33.95,17.01 R28.1 | R28.2 34.96,17.29 36.05,17.29 36.2,17.14 36.2,16.83 v36.34,16.69 37.31,15.71 A1.G1 | J6.2 24.68,15.32 v25.13,15.32
  Top 0.229: C5.1 33.4,13.51 34.3,14.42 34.99,14.42 | U11.7 7.23,7.37
  Top 0.5: R30.2 34.13,16.74 34.33,16.67 | R28.1 34.84,16.12 34.84,14.56 34.99,14.42 36.9,14.42 37.04,14.56 37.04,14.85 A1.G1
  Bottom 0.127: U17.25 19.3,22.16 21.08,22.16 21.21,22.29 U17.3 | U2.2 | J1.5 J1.1 16.05,6.16 16.05,5.86 15.93,5.75 15.43,5.75 15.31,5.86 15.31,6.02 v14.96,6.38
  Bottom 0.229: J1.3 J1.1 | U17.3 21.74,22.38 22.46,23.09 C13.1 | v14.92,24.71 15.04,24.83
  other vias: 33.66,26.04 21.77,32.78 23.75,35.7 8.51,34.43 7.87,31.89 1.52,40.14 29.55,25.62 26.49,25.9 16.21,34.59 18.11,41.57 11.8,30.52 17.91,42.85 15.82,41.58 20.23,39.27 14.43,38.3 33.79,23.04 24.18,26 22.94,32.36 16.4,18.54 15.75,17.53 17.59,19.04 22.71,27.47 26.96,7.25 30.9,3.86 34.43,28.75 28.35,18.86 12.31,27.04 16.19,39.22 31.97,16.41 31.03,18.87 15.76,14.24 34.59,25.77 15.66,21.84 18.62,28.13 17.81,25.9 5.69,8.9 9.74,8.01 10.31,5.31 12.7,8.92 15,8.76 12.26,6.03 12.7,4.64 22.71,29.38 16.43,25.59 15.48,30.35 24.92,13.14 12.85,23.8 26.48,19.34 24.93,17.7 9.14,1.41 7.24,2.68 2.16,9.66 2.16,7.12 18.1,3.17 36.97,17.32 33.81,18.76 35.36,30.28 27.06,5.5 15.38,3 11.82,1.71 18.5,15.34 19.14,17.44 14.08,12.53 12.89,11.63 13.06,10.6 9.21,4.79 11.96,4 18.4,13.74 23.24,17.74 20.95,18.11
  pour Top: 38.73,47.62 38.73,15.88 35.56,15.88 35.56,17.03 31.28,18.53 33.79,15.96 27.7,15.96 27.66,15.93 27.66,5.84 38.28,5.84 38.28,-0.13 0.13,-0.13 0,0 0,47.62
  pour Bottom: 0,46.99 0,-0.64 39.37,-0.64 39.37,47.62 0,47.62
HP_L  (via drill 0.2)
  Top 0.152: v9.14,40.68 9.14,40.26 10.67,38.73 13.34,38.73 13.97,38.1 13.97,32.38 13.82,32.24 J4.2
  Bottom 0.152: U$1.P$4 9.42,40.41 v9.14,40.68
HP_R  (via drill 0.2)
  Top 0.254: v8.83,38.53 6.99,38.53 J4.3
  Bottom 0.152: U$1.P$1 9.75,39.2 9.08,38.53 v8.83,38.53
HP_VGND  (via drill 0.2)
  Top 0.254: v9.17,39.46 9.32,39.31 9.32,37.26 4.2,32.14 J4.4
  Bottom 0.152: U$1.P$2 9.32,39.6 v9.17,39.46
IN-
  Bottom 0.254: R2.2 19.6,32.67 R1.1 18.98,32.4 U2.4
LORA_CS  (via drill 0.2)
  Top 0.152: v27.09,35.67 27.15,35.74 27.18,35.74 27.18,37.32 29,39.14 U4.13P
  Bottom 0.254: U19.11 26.8,35.38 v27.09,35.67
LORA_IRQ0  (via drill 0.2)
  Top 0.152: v27.94,37.41 27.94,35.6 33,30.54 U4.6P
  Bottom 0.254: v27.94,37.41 27.5,36.98 U19.14
LORA_IRQ1  (via drill 0.2)
  Top 0.152: v34.06,32.87 34.06,30.2 35.09,29.18 35.09,23.78 U4.7P
  Bottom 0.152: U19.29 33.62,33.88 34.06,33.44 v34.06,32.87
LORA_MISO  (via drill 0.2)
  Top 0.152: v31.83,37.41 32.52,37.41 U4.10P
  Bottom 0.152: U19.21 31,36.89 31.53,37.41 v31.83,37.41
LORA_MOSI  (via drill 0.2)
  Top 0.152: U4.11P 33,39.65 v31.24,37.9
  Bottom 0.152: v31.24,37.9 30.7,37.9 30,37.2 U19.19
LORA_RST  (via drill 0.2)
  Top 0.152: U4.14P 27,38.97 26.95,37.56 v26.64,37.26
  Bottom 0.152: U19.13 26.98,36.63 26.98,36.91 v26.64,37.26
LORA_SCK  (via drill 0.2)
  Top 0.152: v30.84,37.39 30.67,37.39 30.59,37.47 30.59,38.11 31,38.52 U4.12P
  Bottom 0.152: U19.20 30.5,37.06 v30.84,37.39
MASTER_I2C_SCL  (via drill 0.2)
  Top 0.127: v15.07,25.6 15.32,25.6 16.51,24.47 v16.51,22.38
  Top 0.152: v17.86,7.92 15.68,5.75 v14.88,5.75
  Bottom 0.127: v17.86,7.92 18.57,8.64 18.57,8.89 J1.14 | v15.07,25.6 14.03,25.6 | v16.51,22.38 17.3,22.38 U17.16
  Bottom 0.152: v14.88,5.75 12.6,5.75 12.44,5.59 12.06,5.59 11.25,6.41 11.25,11.88 11.82,12.46 11.82,23.39 14.03,25.6
MASTER_I2C_SDA  (via drill 0.2)
  Top 0.127: v15.23,14.95 13.77,16.41 v13.77,22.74
  Bottom 0.127: J1.12 18.17,8.99 18.17,10.71 18.31,10.85 18.31,12.41 15.77,14.95 v15.23,14.95 | v13.77,22.74 13.98,22.95 15.3,22.95 16.35,21.91 17.3,21.91 U17.15
MEAS_BARO  (via drill 0.2)
  Top 0.127: v18.77,13.2 18.77,13.03 17.92,12.18 17.23,12.18 16.68,12.74 v16.68,12.85 | v17.42,11.21 17.46,11.21 17.82,10.86 18.54,10.86 U5.8
  Bottom 0.127: U17.9 19.56,14.67 18.82,13.93 18.82,13.57 18.77,13.52 v18.77,13.2 | v16.68,12.85 16.68,12.6 17.42,11.85 v17.42,11.21
MEAS_CODEC  (via drill 0.2)
  Top 0.152: v16.76,37.58 16.79,37.6 v19.51,37.6
  Bottom 0.152: U3.4 19.22,37.89 v19.51,37.6 | v16.76,37.58 14.31,35.13 14.31,27.97 14.79,27.5 15.53,27.5 18.54,24.49 U17.20
MEAS_IMU  (via drill 0.2)
  Top 0.127: v23.05,17.11 24.13,17.11 24.52,16.72 v24.52,16.52 | v23.97,10.48 23.81,10.48 22.16,8.83 22.16,5.69 v22.33,5.52 | v15.08,4.87 14.45,5.5 14.45,9.23 14.19,9.49 13.52,9.49 13.52,9.89 13.95,10.32 14.45,10.32 U5.4
  Bottom 0.127: v24.52,16.52 24.43,16.43 24.43,12.53 23.97,12.06 v23.97,10.48 | v22.33,5.52 22.66,5.19 22.66,4.41 22.3,4.05 18.73,4.05 17.91,4.87 v15.08,4.87 | v23.05,17.11 21.36,17.11 20.54,17.94 20.54,18.18 20.07,18.64 U17.8
MEAS_MIC
  Bottom 0.152: U3.8 22.67,37.22 23.27,37.22 24.3,36.19 24.3,33.51 23.63,32.84 22.68,32.84 21.19,31.35 21.19,25.07 21.92,24.35 21.92,23.24 21.57,22.89 U17.2
MEAS_OUT  (via drill 0.2)
  Top 0.152: v18.01,18.38 18.02,18.36 18.02,16.15 v18.03,16.14
  Bottom 0.152: U13.1 11.86,11.69 12.92,12.75 12.92,15.65 13.42,16.15 18.02,16.15 v18.03,16.14 | U17.12 18.03,18.4 v18.01,18.38
MEAS_RFM  (via drill 0.2)
  Top 0.152: v29.58,21.72 29.38,21.52 28.65,21.52 27.5,20.37 25.82,20.37 25.06,21.13 23.59,21.13 23.45,20.99 22.92,20.99 22.57,21.35 v22.57,21.4
  Bottom 0.229: v29.58,21.72 29.98,21.72 30.24,21.46 U6.8 | v22.57,21.4 21.31,21.4 U17.5
MEAS_SAMD  (via drill 0.2)
  Top 0.152: v23.2,21.44 25.16,21.44 25.93,20.66 27.4,20.66 28.63,21.89 v28.63,21.96
  Bottom 0.152: U17.6 21.3,20.83 22.86,20.83 23.21,21.17 23.2,21.18 v23.2,21.44 | U6.4 v28.62,21.96 v28.63,21.96
MIC
  Bottom 0.254: U$1.P$10 12.18,41.45 12.18,41.81 11.27,42.72 C31.2
MIC_BIAS
  Bottom 0.152: R8.1 1.66,36.69 8.38,43.41 12.46,43.41 13.1,42.77 C32.2
  Bottom 0.254: C32.2 13.1,41.08 U$1.P$11
N$1
  Bottom 0.152: U19.43 29.5,28.47 C1.1
N$2  (via drill 0.2)
  Top 0.5: SJ3.3 32.37,20.51 v34.19,20.51
  Bottom 0.5: v34.19,20.51 34.83,20.51 X4.3
N$3
  Bottom 0.254: R4.2 16.82,31.3 U2.3 | R3.1 16.8,32.98 R4.2 | C8.1 R4.2
N$4
  Top 0.229: C3.2 35.6,6.6 A1.G2 33.59,6.81 C5.2
N$5
  Bottom 0.203: U19.1 26.26,30.38 X2.P$1 22.65,28.36 C2.1
N$6
  Bottom 0.254: C6.2 R1.2
N$7
  Bottom 0.203: U19.2 26.16,30.76 X2.P$2 C4.1
N$8  (via drill 0.2)
  Top 0.229: JP13.1 13.59,14.59 13.66,14.52 v13.93,14.52
  Bottom 0.229: v13.93,14.52 14.01,14.44 14.01,13.96
  Bottom 0.508: R_SENSE.2 14.01,13.96
N$9
  Top 0.5: C26.1 29.7,18.29 29.05,18.94 29.05,20.25 SJ3.1
N$11
  Top 0.254: R7.1 16.88,44.09 X6.3
N$12
  Top 0.229: R9.1 17.18,20.63 SW1.2 17.07,20.52 17.07,16.69 SW1.4
N$13
  Top 0.127: R30.1 32.58,17.34 32.51,17.32 | R27.1 31.69,17.65 31.61,17.65
  Top 0.5: C26.2 31.61,17.65 | R27.1 32.51,17.32
N$19
  Bottom 0.203: R11.2 25.08,40.64 27.33,38.39 31.54,38.39 33.83,36.1 33.83,35.66 33.55,35.38 U19.26
N$20  (via drill 0.2)
  Top 0.203: v21.88,40.93 21.59,41.22 RED_LED.A
  Bottom 0.203: R11.1 22.17,40.64 v21.88,40.93
N$22
  Bottom 0.229: U17.14 17.17,21.2 16.83,21.2 16.19,20.55 X1.P$1 14.84,20.97 C16.2
N$23
  Bottom 0.127: C15.2 14.03,17.76 X1.P$2
  Bottom 0.229: U17.13 14.64,18.16 X1.P$2
N$25  (via drill 0.2)
  Top 0.254: J4.1 1.28,33.57 v1.66,33.95
  Bottom 0.152: C31.1 10.08,42.66 8.03,42.66 3.14,37.77 3.14,36.56 R8.2 v1.65,33.96 v1.66,33.95
N$26
  Top 0.152: SJ3.2 30.82,21.22 29.55,22.49 24.41,22.49 23.2,23.69
  Top 0.305: 23.2,23.69 U4.1P
OUT  (via drill 0.2)
  Top 0.254: v20.57,34.85 20.57,36.05 MK1.1
  Bottom 0.254: v20.57,34.85 C6.1
SAMD_!RESET  (via drill 0.2)
  Top 0.152: SW2.4 SW2.2 14.19,29.43 v15.77,29.43 | 21.32,27.01 29.18,27.01 v31.04,28.87 | J3.10 21.32,27.01 | 21.32,27.01 20.62,27.01 20.24,27.39 v20.24,27.41
  Bottom 0.152: v15.77,29.43 15.77,29.32 16.47,28.63 19.77,28.63 20.24,28.16 v20.24,27.41
  Bottom 0.229: v31.04,28.87 31.04,29.62 U19.40
SWCLK  (via drill 0.2)
  Top 0.254: v28.5,28.37 27.29,28.37 25.64,30.02 J3.4
  Bottom 0.127: U19.45 28.51,29.65 28.52,29.63
  Bottom 0.254: v28.5,28.37 28.52,28.4 28.52,29.63
SWDIO  (via drill 0.2)
  Top 0.254: J3.2 25.64,31.29 v28.03,28.91
  Bottom 0.254: v28.03,28.91 28,28.93 U19.46
VAG
  Bottom 0.254: C28.1 10.03,40.81 U$1.P$5

## Text on the board
tPlace: O | S | L | SAMD DEBUG | PDBG | PRST | U.Fl | ATRST | ATDBG | IMU | MS5637
bPlace: CS Daughter Card v2 / Eve Hu 9/12/2020 | SAMD21 | ATTINY